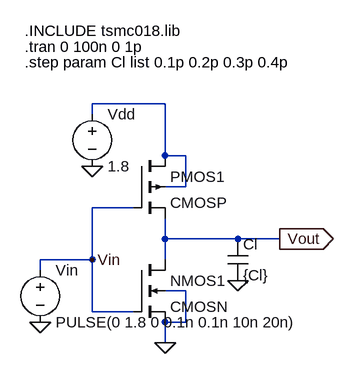
[diagram p0: schematic cmos-inverter-with-cap.asc]
cmos-inverter-with-cap.asc, the LTspice schematic file:
Version 4
SHEET 1 1108 680
WIRE 352 112 240 112
WIRE 240 128 240 112
WIRE 352 192 352 112
WIRE 384 192 352 192
WIRE 384 240 384 192
WIRE 384 240 352 240
WIRE 304 272 240 272
WIRE 352 320 352 288
WIRE 464 320 352 320
WIRE 528 320 464 320
WIRE 240 352 240 272
WIRE 240 352 160 352
WIRE 352 352 352 320
WIRE 160 368 160 352
WIRE 384 400 352 400
WIRE 240 432 240 352
WIRE 304 432 240 432
WIRE 384 448 384 400
WIRE 384 448 352 448
WIRE 352 480 352 448
FLAG 352 480 0
FLAG 240 208 0
FLAG 160 448 0
FLAG 528 320 Vout
IOPIN 528 320 Out
FLAG 240 352 Vin
FLAG 464 384 0
SYMBOL cmosn 304 352 R0
SYMATTR InstName NMOS1
SYMATTR Value2 l=180n w=180n
SYMBOL cmosp 304 192 R0
SYMATTR InstName PMOS1
SYMATTR Value2 l=180n w=180n
SYMBOL Voltage 240 112 R0
WINDOW 0 24 16 Left 0
WINDOW 3 24 96 Left 0
SYMATTR InstName Vdd
SYMATTR Value 1.8
SYMBOL Voltage 160 352 R0
WINDOW 0 24 16 Left 0
WINDOW 3 24 96 Left 0
SYMATTR InstName Vin
SYMATTR Value PULSE(0 1.8 0 0.1n 0.1n 10n 20n)
SYMBOL Cap 448 320 R0
WINDOW 0 24 8 Left 0
WINDOW 3 24 56 Left 0
SYMATTR InstName Cl
SYMATTR Value {Cl}
TEXT 136 0 Left 0 !.INCLUDE tsmc018.lib
TEXT 136 24 Left 0 !.tran 0 100n 0 1p
TEXT 136 48 Left 0 !.step param Cl list 0.1p 0.2p 0.3p 0.4p

The netlist it stands for:
* cmos-inverter-with-cap.asc
M§NMOS1 Vout Vin 0 0 CMOSN l=180n w=180n
M§PMOS1 N001 Vin Vout N001 CMOSP l=180n w=180n
Vdd N001 0 1.8
Vin Vin 0 PULSE(0 1.8 0 0.1n 0.1n 10n 20n)
Cl Vout 0 {Cl}
.model NMOS NMOS
.model PMOS PMOS
.lib standard.mos
.INCLUDE tsmc018.lib
.tran 0 100n 0 1p
.step param Cl list 0.1p 0.2p 0.3p 0.4p
.backanno
.end